# Altium project ttc2_project.prjpcb (part 2 of 2)

## Sheet 4_mcu_radio_1.schdoc: MCU Radio 1
size A3; DrawnBy: Sara Vega Martinez; Revision: v0.1; SheetNumber: 4; SheetTotal: 6; DesignedBy: André M. P. Mattos; ProjectRevision: v0.1
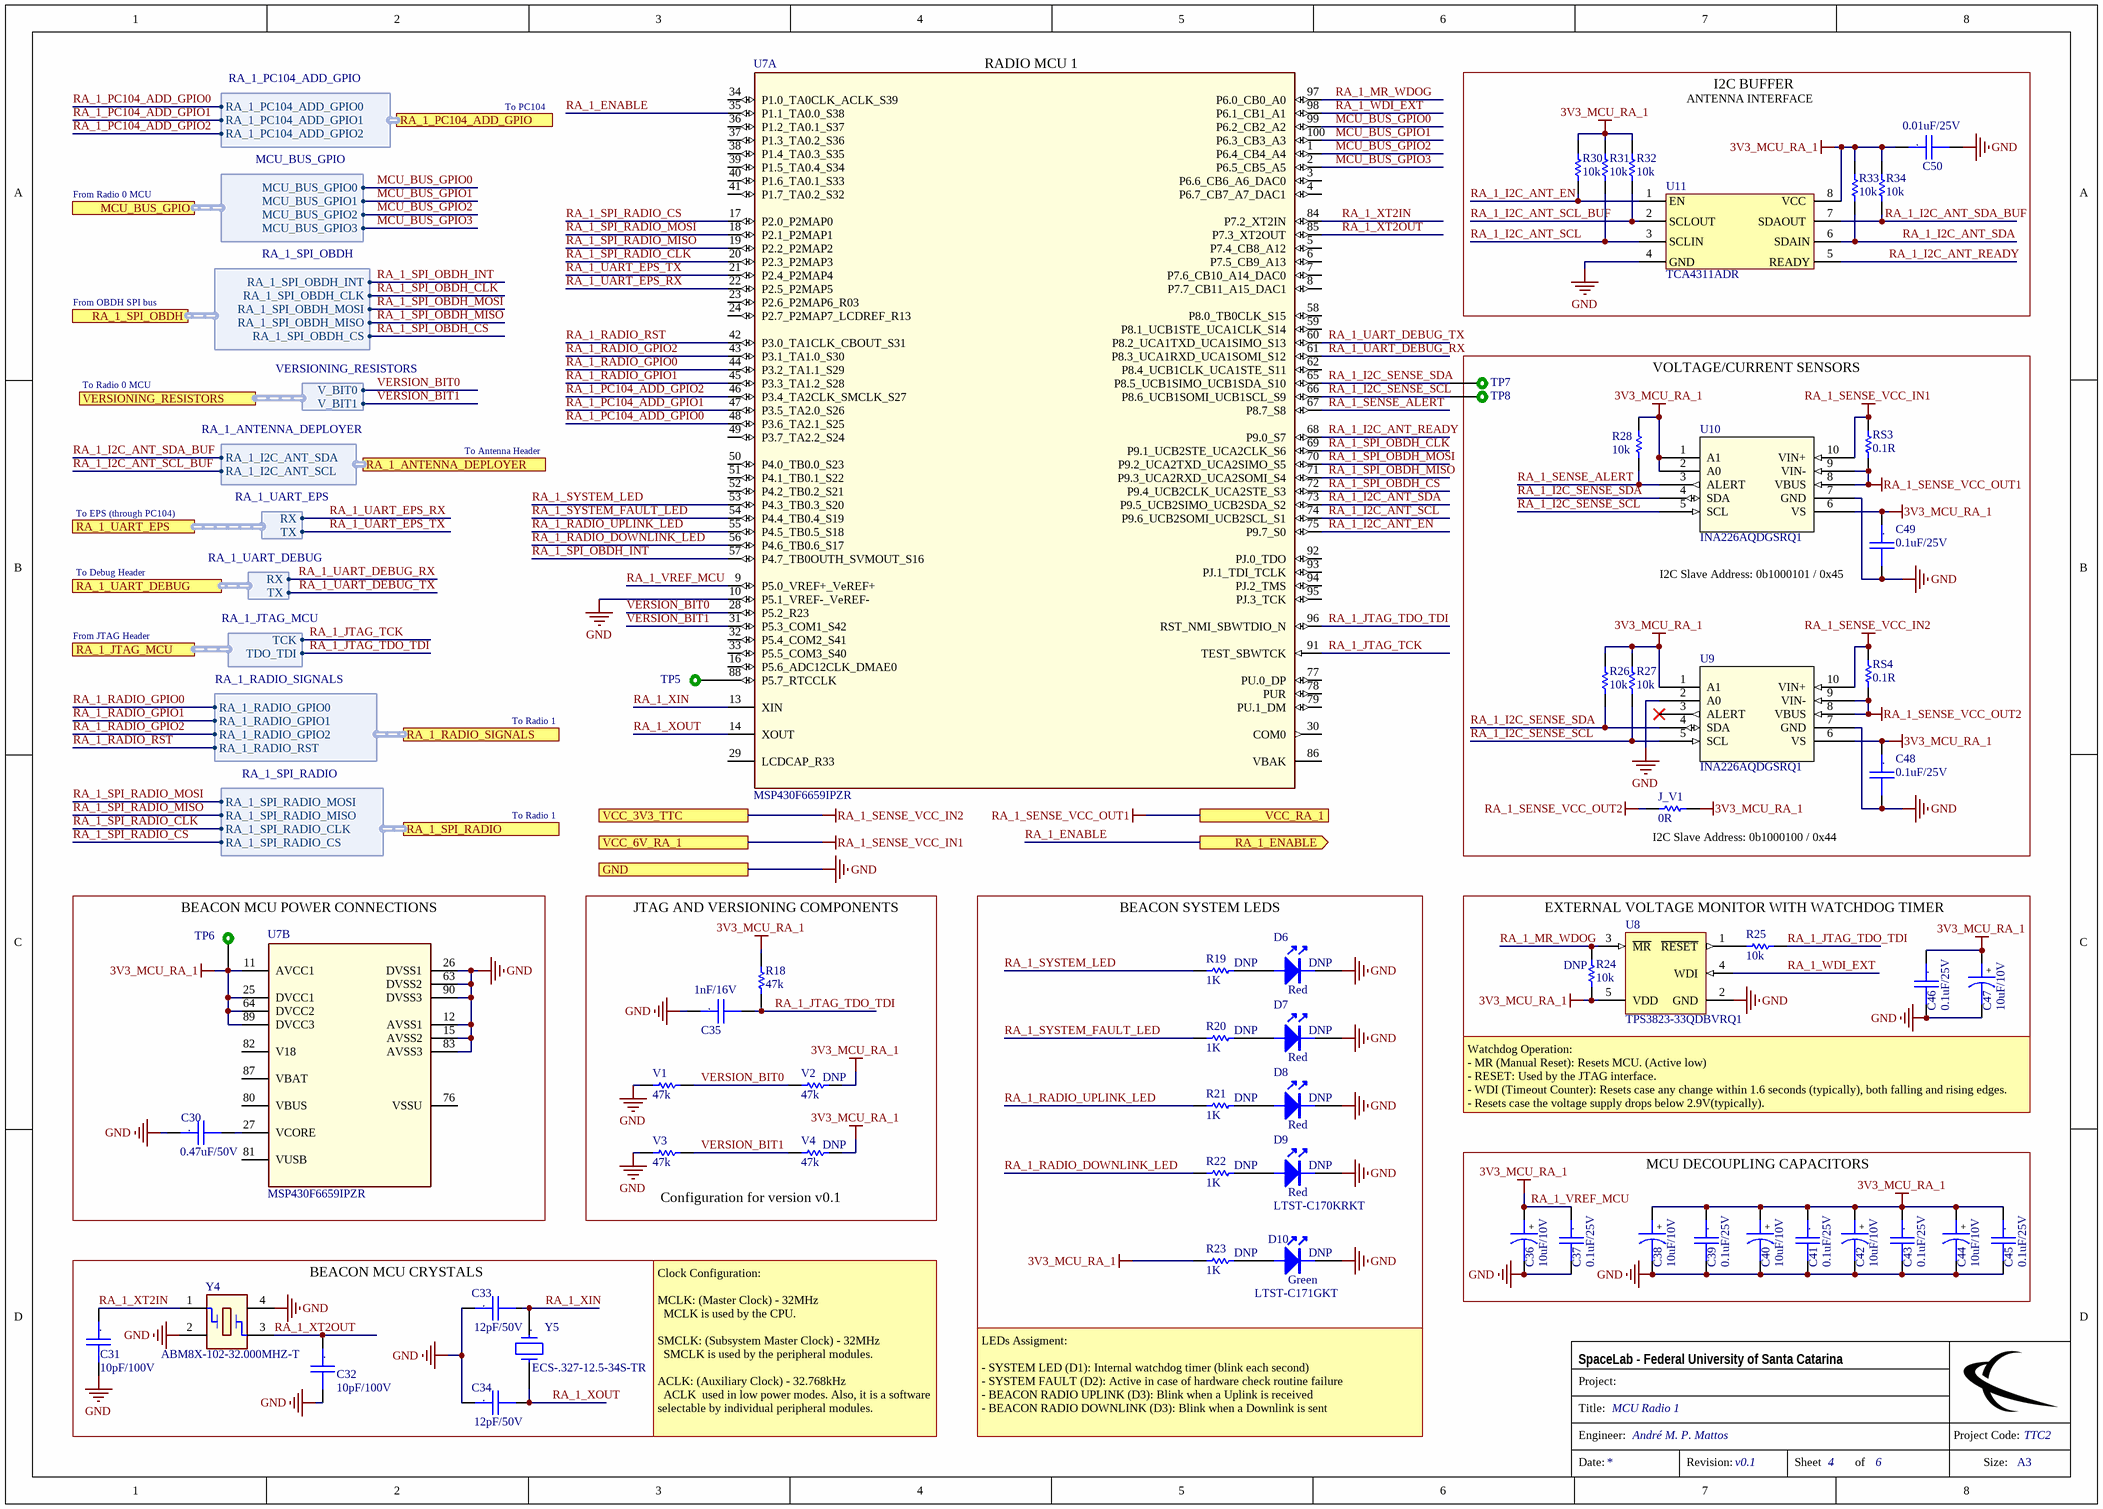
[diagram p5: 4_mcu_radio_1.schdoc]

### Parts
C30  0.47uF/50V  [CC0805]
C31  10pF/100V  [CC0805]
C32  10pF/100V  [CC0805]
C33  12pF/50V  [CC0805]
C34  12pF/50V  [CC0805]
C35  1nF/16V  [CC0603]
C36  10uF/10V  [CC0805_Tantalum]
C37  0.1uF/25V  [CC0805]
C38  10uF/10V  [CC0805_Tantalum]
C39  0.1uF/25V  [CC0805]
C40  10uF/10V  [CC0805_Tantalum]
C41  0.1uF/25V  [CC0805]
C42  10uF/10V  [CC0805_Tantalum]
C43  0.1uF/25V  [CC0805]
C44  10uF/10V  [CC0805_Tantalum]
C45  0.1uF/25V  [CC0805]
C46  0.1uF/25V  [CC0805]
C47  10uF/10V  [CC0805_Tantalum]
C48  0.1uF/25V  [CC0805]
C49  0.1uF/25V  [CC0805]
C50  0.01uF/25V  [CC0805]
D6  LTST-C170KRKT  [0805-RED-LED]  (value not drawn)
D7  LTST-C170KRKT  [0805-RED-LED]  (value not drawn)
D8  LTST-C170KRKT  [0805-RED-LED]  (value not drawn)
D9  LTST-C170KRKT  [0805-RED-LED]
D10  LTST-C171GKT  [0805-GREEN-LED]
J_V1  0R  [0805]
R18  47k  [0805]
R19  1K  [0805]
R20  1K  [0805]
R21  1K  [0805]
R22  1K  [0805]
R23  1K  [0805]
R24  10k  [0805]
R25  10k  [0805]
R26  10k  [0805]
R27  10k  [0805]
R28  10k  [0805]
R30  10k  [0805]
R31  10k  [0805]
R32  10k  [0805]
R33  10k  [0805]
R34  10k  [0805]
RS3  0.1R  [0805]
RS4  0.1R  [0805]
TP5  TEST_POINT  [TEST_POINT]  (value not drawn)  (no BOM)
TP6  TEST_POINT  [TEST_POINT]  (value not drawn)  (no BOM)
TP7  TEST_POINT  [TEST_POINT]  (value not drawn)  (no BOM)
TP8  TEST_POINT  [TEST_POINT]  (value not drawn)  (no BOM)
U7  MSP430F6659IPZR  [LQFP-100]  (parts A,B of 2)
U8  TPS3823-33QDBVRQ1  [DBV0005A_N]
U9  INA226AQDGSRQ1  [DGS10]
U10  INA226AQDGSRQ1  [DGS10]
U11  TCA4311ADR  [SOIC8]
V1  47k  [0805]
V2  47k  [0805]
V3  47k  [0805]
V4  47k  [0805]
Y4  ABM8X-102-32.000MHZ-T  [XTAL_ABM8X]
Y5  ECS-.327-12.5-34S-TR  [ABS06 0805]

### Blocks framed on the sheet
I2C BUFFER: C50 R30-R34 U11
VOLTAGE/CURRENT SENSORS: C48 C49 J_V1 R26-R28 RS3 RS4 TP7 TP8 U9 U10
BEACON MCU POWER CONNECTIONS: C30 TP6 U7
BEACON SYSTEM LEDS: D6-D10 R19-R23
EXTERNAL VOLTAGE MONITOR WITH WATCHDOG TIMER: C46 C47 R24 R25 U8
MCU DECOUPLING CAPACITORS: C36-C45
BEACON MCU CRYSTALS: C31-C34 Y4 Y5

### Ports
GND, MCU_BUS_GPIO (harness MCU_BUS_GPIO), RA_1_ANTENNA_DEPLOYER (harness RA_1_ANTENNA_DEPLOYER), RA_1_ENABLE (out), RA_1_JTAG_MCU (harness RA_1_JTAG_MCU), RA_1_PC104_ADD_GPIO (harness RA_1_PC104_ADD_GPIO), RA_1_RADIO_SIGNALS (harness RA_1_RADIO_SIGNALS), RA_1_SPI_OBDH (harness RA_1_SPI_OBDH), RA_1_SPI_RADIO (harness RA_1_SPI_RADIO), RA_1_UART_DEBUG (harness RA_1_UART_DEBUG), RA_1_UART_EPS (harness RA_1_UART_EPS), VCC_3V3_TTC, VCC_6V_RA_1, VCC_RA_1, VERSIONING_RESISTORS (harness VERSIONING_RESISTORS)

### Harnesses
RA_1_UART_EPS: RX, TX
RA_1_PC104_ADD_GPIO: RA_1_PC104_ADD_GPIO2, RA_1_PC104_ADD_GPIO1, RA_1_PC104_ADD_GPIO0
RA_1_RADIO_SIGNALS: RA_1_RADIO_GPIO2, RA_1_RADIO_RST, RA_1_RADIO_GPIO0, RA_1_RADIO_GPIO1
RA_1_SPI_RADIO: RA_1_SPI_RADIO_CLK, RA_1_SPI_RADIO_MISO, RA_1_SPI_RADIO_MOSI, RA_1_SPI_RADIO_CS
RA_1_JTAG_MCU: TDO_TDI, TCK
RA_1_UART_DEBUG: RX, TX
RA_1_ANTENNA_DEPLOYER: RA_1_I2C_ANT_SCL, RA_1_I2C_ANT_SDA
RA_1_SPI_OBDH: RA_1_SPI_OBDH_CLK, RA_1_SPI_OBDH_MOSI, RA_1_SPI_OBDH_MISO, RA_1_SPI_OBDH_CS, RA_1_SPI_OBDH_INT
MCU_BUS_GPIO: MCU_BUS_GPIO0, MCU_BUS_GPIO1, MCU_BUS_GPIO2, MCU_BUS_GPIO3
VERSIONING_RESISTORS: V_BIT0, V_BIT1

### Nets
GND: C30.1 C31.2 C32.2 C33.1 C34.1 C35.1 C36.2 C37.2 C38.2 C39.2 C40.2 C41.2 C42.2 C43.2 C44.2 C45.2 C46.2 C47.2 C48.2 C49.2 C50.2 D6.2(K) D7.2(K) D8.2(K) D9.2(K) D10.2(K) U7.10(P5.1_VREF-_VeREF-) U7.12(AVSS1) U7.15(AVSS2) U7.26(DVSS1) U7.63(DVSS2) U7.83(AVSS3) U7.90(DVSS3) U8.2(GND) U9.2(A0) U9.7(GND) U10.7(GND) U11.4(GND) V1.2 V3.2 Y4.2 Y4.4 ; port GND
RA_1_SENSE_VCC_IN1: RS3.2 U10.10(VIN+) ; port VCC_6V_RA_1  [project net VCC_6V_RA_1]
RA_1_SENSE_VCC_IN2: RS4.2 U9.10(VIN+) ; port VCC_3V3_TTC  [project net VCC_3V3_TTC]
RA_1_SENSE_VCC_OUT1: RS3.1 U10.8(VBUS) U10.9(VIN-) ; port VCC_RA_1
RA_1_SENSE_VCC_OUT2: J_V1.2 RS4.1 U9.8(VBUS) U9.9(VIN-)
RA_1_VREF_MCU: C36.1 C37.1 C38.1 C39.1 C40.1 C41.1 C42.1 C43.1 C44.1 C45.1 C46.1 C47.1 C48.1 C49.1 C50.1 J_V1.1 R18.2 R23.2 R24.1 R26.2 R27.2 R28.2 R30.2 R31.2 R32.2 R33.2 R34.2 TP6.1 U7.9(P5.0_VREF+_VeREF+) U7.11(AVCC1) U7.25(DVCC1) U7.64(DVCC2) U7.89(DVCC3) U8.5(VDD) U9.1(A1) U9.6(VS) U10.1(A1) U10.2(A0) U10.6(VS) U11.8(VCC) V2.1 V4.1  [also labelled 3V3_MCU_RA_1]
MCU_BUS_GPIO0: U7.99(P6.2_CB2_A2) ; port MCU_BUS_GPIO.MCU_BUS_GPIO0
MCU_BUS_GPIO1: U7.100(P6.3_CB3_A3) ; port MCU_BUS_GPIO.MCU_BUS_GPIO1
MCU_BUS_GPIO2: U7.1(P6.4_CB4_A4) ; port MCU_BUS_GPIO.MCU_BUS_GPIO2
MCU_BUS_GPIO3: U7.2(P6.5_CB5_A5) ; port MCU_BUS_GPIO.MCU_BUS_GPIO3
RA_1_ENABLE: U7.35(P1.1_TA0.0_S38) ; port RA_1_ENABLE
RA_1_I2C_ANT_EN: R30.1 U7.75(P9.7_S0) U11.1(EN)
RA_1_I2C_ANT_READY: U7.68(P9.0_S7) U11.5(READY)
RA_1_I2C_ANT_SCL: R31.1 U7.74(P9.6_UCB2SOMI_UCB2SCL_S1) U11.3(SCLIN)
RA_1_I2C_ANT_SCL_BUF: R32.1 U11.2(SCLOUT) ; port RA_1_ANTENNA_DEPLOYER.RA_1_I2C_ANT_SCL
RA_1_I2C_ANT_SDA: R33.1 U7.73(P9.5_UCB2SIMO_UCB2SDA_S2) U11.6(SDAIN)
RA_1_I2C_ANT_SDA_BUF: R34.1 U11.7(SDAOUT) ; port RA_1_ANTENNA_DEPLOYER.RA_1_I2C_ANT_SDA
RA_1_I2C_SENSE_SCL: R27.1 TP8.1 U7.66(P8.6_UCB1SOMI_UCB1SCL_S9) U9.5(SCL) U10.5(SCL)
RA_1_I2C_SENSE_SDA: R26.1 TP7.1 U7.65(P8.5_UCB1SIMO_UCB1SDA_S10) U9.4(SDA) U10.4(SDA)
RA_1_JTAG_TCK: U7.91(TEST_SBWTCK) ; port RA_1_JTAG_MCU.TCK
RA_1_JTAG_TDO_TDI: C35.2 R18.1 R25.1 U7.96(RST_NMI_SBWTDIO_N) ; port RA_1_JTAG_MCU.TDO_TDI
RA_1_MR_WDOG: R24.2 U7.97(P6.0_CB0_A0) U8.3(~{MR})
RA_1_PC104_ADD_GPIO0: U7.48(P3.6_TA2.1_S25) ; port RA_1_PC104_ADD_GPIO.RA_1_PC104_ADD_GPIO0
RA_1_PC104_ADD_GPIO1: U7.47(P3.5_TA2.0_S26) ; port RA_1_PC104_ADD_GPIO.RA_1_PC104_ADD_GPIO1
RA_1_PC104_ADD_GPIO2: U7.46(P3.4_TA2CLK_SMCLK_S27) ; port RA_1_PC104_ADD_GPIO.RA_1_PC104_ADD_GPIO2
RA_1_RADIO_DOWNLINK_LED: R22.2 U7.56(P4.6_TB0.6_S17)
RA_1_RADIO_GPIO0: U7.44(P3.2_TA1.1_S29) ; port RA_1_RADIO_SIGNALS.RA_1_RADIO_GPIO0
RA_1_RADIO_GPIO1: U7.45(P3.3_TA1.2_S28) ; port RA_1_RADIO_SIGNALS.RA_1_RADIO_GPIO1
RA_1_RADIO_GPIO2: U7.43(P3.1_TA1.0_S30) ; port RA_1_RADIO_SIGNALS.RA_1_RADIO_GPIO2
RA_1_RADIO_RST: U7.42(P3.0_TA1CLK_CBOUT_S31) ; port RA_1_RADIO_SIGNALS.RA_1_RADIO_RST
RA_1_RADIO_UPLINK_LED: R21.2 U7.55(P4.5_TB0.5_S18)
RA_1_SENSE_ALERT: R28.1 U7.67(P8.7_S8) U10.3(ALERT)
RA_1_SPI_OBDH_CLK: U7.69(P9.1_UCB2STE_UCA2CLK_S6) ; port RA_1_SPI_OBDH.RA_1_SPI_OBDH_CLK
RA_1_SPI_OBDH_CS: U7.72(P9.4_UCB2CLK_UCA2STE_S3) ; port RA_1_SPI_OBDH.RA_1_SPI_OBDH_CS
RA_1_SPI_OBDH_INT: U7.57(P4.7_TB0OUTH_SVMOUT_S16) ; port RA_1_SPI_OBDH.RA_1_SPI_OBDH_INT
RA_1_SPI_OBDH_MISO: U7.71(P9.3_UCA2RXD_UCA2SOMI_S4) ; port RA_1_SPI_OBDH.RA_1_SPI_OBDH_MISO
RA_1_SPI_OBDH_MOSI: U7.70(P9.2_UCA2TXD_UCA2SIMO_S5) ; port RA_1_SPI_OBDH.RA_1_SPI_OBDH_MOSI
RA_1_SPI_RADIO_CLK: U7.20(P2.3_P2MAP3) ; port RA_1_SPI_RADIO.RA_1_SPI_RADIO_CLK
RA_1_SPI_RADIO_CS: U7.17(P2.0_P2MAP0) ; port RA_1_SPI_RADIO.RA_1_SPI_RADIO_CS
RA_1_SPI_RADIO_MISO: U7.19(P2.2_P2MAP2) ; port RA_1_SPI_RADIO.RA_1_SPI_RADIO_MISO
RA_1_SPI_RADIO_MOSI: U7.18(P2.1_P2MAP1) ; port RA_1_SPI_RADIO.RA_1_SPI_RADIO_MOSI
RA_1_SYSTEM_FAULT_LED: R20.2 U7.54(P4.4_TB0.4_S19)
RA_1_SYSTEM_LED: R19.2 U7.53(P4.3_TB0.3_S20)
RA_1_UART_DEBUG_RX: U7.61(P8.3_UCA1RXD_UCA1SOMI_S12) ; port RA_1_UART_DEBUG.RX
RA_1_UART_DEBUG_TX: U7.60(P8.2_UCA1TXD_UCA1SIMO_S13) ; port RA_1_UART_DEBUG.TX
RA_1_UART_EPS_RX: U7.22(P2.5_P2MAP5) ; port RA_1_UART_EPS.RX
RA_1_UART_EPS_TX: U7.21(P2.4_P2MAP4) ; port RA_1_UART_EPS.TX
RA_1_WDI_EXT: U7.98(P6.1_CB1_A1) U8.4(WDI)
RA_1_XIN: C33.2 U7.13(XIN) Y5.1
RA_1_XOUT: C34.2 U7.14(XOUT) Y5.2
RA_1_XT2IN: C31.1 U7.84(P7.2_XT2IN) Y4.1
RA_1_XT2OUT: C32.1 U7.85(P7.3_XT2OUT) Y4.3
VERSION_BIT0: U7.28(P5.2_R23) V1.1 V2.2 ; port VERSIONING_RESISTORS.V_BIT0
VERSION_BIT1: U7.31(P5.3_COM1_S42) V3.1 V4.2 ; port VERSIONING_RESISTORS.V_BIT1
NetC30_2: C30.2 U7.27(VCORE)
NetD6_1: D6.1(A) R19.1
NetD7_1: D7.1(A) R20.1
NetD8_1: D8.1(A) R21.1
NetD9_1: D9.1(A) R22.1
NetD10_1: D10.1(A) R23.1
NetR25_2: R25.2 U8.1(~{RESET})
NetTP5_1: TP5.1 U7.88(P5.7_RTCCLK)

Not connected (* = marked no-connect by the designer): U7 3(P6.6_CB6_A6_DAC0) 4(P6.7_CB7_A7_DAC1) 5(P7.4_CB8_A12) 6(P7.5_CB9_A13) 7(P7.6_CB10_A14_DAC0) 8(P7.7_CB11_A15_DAC1) 16(P5.6_ADC12CLK_DMAE0) 23(P2.6_P2MAP6_R03) 24(P2.7_P2MAP7_LCDREF_R13) 29(LCDCAP_R33) 30(COM0) 32(P5.4_COM2_S41) 33(P5.5_COM3_S40) 34(P1.0_TA0CLK_ACLK_S39) 36(P1.2_TA0.1_S37) 37(P1.3_TA0.2_S36) 38(P1.4_TA0.3_S35) 39(P1.5_TA0.4_S34) 40(P1.6_TA0.1_S33) 41(P1.7_TA0.2_S32) 49(P3.7_TA2.2_S24) 50(P4.0_TB0.0_S23) 51(P4.1_TB0.1_S22) 52(P4.2_TB0.2_S21) 58(P8.0_TB0CLK_S15) 59(P8.1_UCB1STE_UCA1CLK_S14) 62(P8.4_UCB1CLK_UCA1STE_S11) 76(VSSU) 77(PU.0_DP) 78(PUR) 79(PU.1_DM) 80(VBUS) 81(VUSB) 82(V18) 86(VBAK) 87(VBAT) 92(PJ.0_TDO) 93(PJ.1_TDI_TCLK) 94(PJ.2_TMS) 95(PJ.3_TCK); U9 3(ALERT)*

### Notes on the sheet
- To PC104
- (near U7) RADIO MCU 1
- ANTENNA INTERFACE
- From Radio 0 MCU
- From OBDH SPI bus
- To Radio 0 MCU
- To Antenna Header
- To EPS (through PC104)
- To Debug Header
- I2C Slave Address: 0b1000101 / 0x45
- From JTAG Header
- To Radio 1
- (near J_V1) I2C Slave Address: 0b1000100 / 0x44
- (near R18) JTAG AND VERSIONING COMPONENTS
- (near R19) DNP
- (near D6) DNP
- (near R24) DNP
- (near R20) DNP
- (near D7) DNP
- (near V2) DNP
- (near R21) DNP
- (near D8) DNP
- Watchdog Operation:
  - MR (Manual Reset): Resets MCU. (Active low)
  - RESET: Used by the JTAG interface.
  - WDI (Timeout Counter): Resets case any change within 1.6 seconds (typically), both falling and rising edges.
  - Resets case the voltage supply drops below 2.9V(typically).
- (near V4) DNP
- (near R22) DNP
- (near D9) DNP
- Configuration for version v0.1
- (near R23) DNP
- (near D10) DNP
- Clock Configuration:
  MCLK: (Master Clock) - 32MHz
  MCLK is used by the CPU.
  SMCLK: (Subsystem Master Clock) - 32MHz
  SMCLK is used by the peripheral modules.
  ACLK: (Auxiliary Clock) - 32.768kHz
  ACLK  used in low power modes. Also, it is a software selectable by individual peripheral modules.
- LEDs Assigment:
  - SYSTEM LED (D1): Internal watchdog timer (blink each second)
  - SYSTEM FAULT (D2): Active in case of hardware check routine failure
  - BEACON RADIO UPLINK (D3): Blink when a Uplink is received
  - BEACON RADIO DOWNLINK (D3): Blink when a Downlink is sent
- Project:
- SpaceLab - Federal University of Santa Catarina
- Title:
- Engineer:
- Project Code:
- Date:
- Revision:
- Sheet
- of
- Size:
- A3
- (in symbol Cap_Cer_X7R_0.1uF_25V_0805) .
- (in symbol Cap_Cer_X7R_0.01uF_25V_0805) .
- (in symbol Cap_Cer_X7R_0.47uF_50V_0805) .
- (in symbol Cap_Cer_X7R_1nF_16V_0603) .
- (in symbol Cap_Cer_X7R_10pF_100V_0805) .
- (in symbol Cap_Cer_X7R_12pF_50V_0805) .
- (in symbol Cap_Tant_SMD_10uF_10V_0805) +
- (in symbol LED/G_0805) Green
- (in symbol LED/R_0805) Red
- (in symbol Xtal_32.768kHz_12pF_2_SMD) .

### Library data of the parts
C30 = Cap_Cer_X7R_0.47uF_50V_0805: CAP CER 0.47UF 50V 10% X7R 0805; Partnumber: C0805C474K5RACTU; NCM: 8532.24.10
C31 C32 = Cap_Cer_X7R_10pF_100V_0805: CAP CER 10pF 100V 0805; Partnumber: 08051A100FAT2A; NCM: 8532.24.10
C33 C34 = Cap_Cer_X7R_12pF_50V_0805: CAP CER 12pF 50V 0805; Partnumber: CL21C120FBANNNC; NCM: 8532.24.10
C35 = Cap_Cer_X7R_1nF_16V_0603: CAP CER 1nF 16V 0603 5%; Partnumber: C0603X102J4RECAUTO; NCM: 8532.24.10
C36 C38 C40 C42 C44 C47 = Cap_Tant_SMD_10uF_10V_0805: CAP Tantalum 10uF 10V 20% 0805; Partnumber: TPSP106M010R2000; NCM: 8532.21.11
C37 C39 C41 C43 C45 C46 C48 C49 = Cap_Cer_X7R_0.1uF_25V_0805: CAP CER 0.1UF 25V 10% X7R 0805; Partnumber: CC0805KRX7R8BB104; NCM: 8532.24.10
C50 = Cap_Cer_X7R_0.01uF_25V_0805: CAP CER 0.01uF 25V 10% X7R 0805; Partnumber: CL21B103KAANNNC; NCM: 8532.24.10
D6-D9 = LED/R_0805: LED Red SMD - Red 631nm LED Indication, Discrete 2V 0805 (2012 Metric); NCM: 8541.40.21; Partnumber: LTST-C170KRKT
D10 = LED/G_0805: LED Green SMD - Green 569nm LED Indication - Discrete 2.1V 0805 (2012 Metric); NCM: 8541.40.21; Partnumber: LTST-C171GKT
J_V1 = R0R_JUMPER_1/8W_0805: RES 0R OHM 1/8W JUMPER 0805; Partnumber: CRCW08050000Z0EA; NCM: 8533.21.20
R18 V1-V4 = R47k_1%_1/8W_0805: RES 47k OHM 1/8W 1% 0805; Partnumber: RC0805FR-0747KL; NCM: 8533.21.20
R19-R23 = R1.0k_1%_1/8W_0805: RES 1.0K OHM 1/8W 1% 0805; Partnumber: RC0805FR-071KL; NCM: 8533.21.20
R24-R28 R30-R34 = R10k_1%_1/8W_0805: RES 10K OHM 1/8W 1%  0805; Partnumber: CRCW080510K0FKEA; NCM: 8533.21.20
RS3 RS4 = R0.1R_1%_1/3W_0805: RES 0.1R OHM 1/3W 1% 0805; Partnumber: SR732ATTER100F; NCM: 8533.21.20
TP5-TP8 = TEST_POINT: Test point
U7 = MSP430F6659IPZR: CPUXV2 series Microcontroller IC 16-Bit 20MHz 512KB (512K x 8) FLASH 100-LQFP (14x14); Manufacturer: Texas Instruments; PIN_COUNT: 100; Application_BuildNumber: *; PartNumber: MSP430F6659IPZR; Alternate PartNumber: MSP430F6659IPZ; PackageReference: PZ0100A; MountType: SMT; CompType: IC; RoHS: Y; RefDes: RefDes; Type: DEV; Value: Value
U8 = CMP-0338-00011-2: Processor Supervisory Circuit, 1 Supply Monitored, -40 to 85 degC, 5-Pin SOT-23 (DBV), Green (RoHS & no Sb/Br); Manufacturer: Texas Instruments; Iq: 15 uA Typ.; Threshold Voltage: 2.93 V Typ.; Watchdog Timer WDI: 0.2 s; VCC: 1.1 V Min.; Reset Threshold Accuracy: 2.4%; Rating: Catalog; Time Delay: 25 ms; # of Supplies Monitored: 1; Output Driver Type / Reset Output: Active-low, Push-pull; Packing: Tape and Reel; ComponentLink1Description: Manufacturer URL; RoHS: TRUE; PackageDescription: 5-Pin Plastic Small Outline, Body 1.6 x 2.9 mm, Pitch 0.95 mm; Mounting Technology: Surface Mount; ComponentLink1URL: www.ti.com; PackageReference: DBV0005A; ComponentLink3URL: http://www.ti.com/lit/ml/mpds018j/mpds018j.pdf; ComponentLink3Description: Package Specification; PartNumber: TPS3823-33QDBVRQ1; DatasheetVersion: SLVS165J; ComponentLink2Description: Datasheet; PackageVersion: 4073253-4/L; ComponentLink2URL: http://www.ti.com/lit/ds/symlink/tps3820-33.pdf; Operating Temperature Range: -40 to 85 degC
U9 U10 = INA226AQDGSRQ1: High-Side Measurement, Bi-Directional Current/Power Monitor w/I2C Interface; Manufacturer: Texas Instruments; GENERIC_PART_NUMBER: INA226; INDUSTRY_STD_PKG_TYPE: MSOP; FAMILY_NAME: CURRENT SHUNT MONITOR; PIN_COUNT: 10; PACKAGE_DESIGNATOR: DGS; Datasheet_URL: http://www.ti.com/lit/gpn/INA226; Vendor: Texas Instruments; Manufacturer_Part_Number: INA226AQDGSRQ1; Copyright: Copyright (C) 2018 Accelerated Designs. All rights reserved; RefDes: RefDes; Type: DEV; Partnumber: INA226AQDGSRQ1
U11 = TCA4311ADR: IC SIGNAL BUFFER I2C 8SOIC HOTSWAP; Partnumber: TCA4311ADR
Y4 = XTAL_32MHz_SMD_4-SMD: 32MHz ±10ppm Crystal 10pF 60 Ohm -40°C ~ 125°C; Partnumber: ABM8X-102-32.000MHZ-T; NCM: 8541.60.10
Y5 = Xtal_32.768kHz_12pF_2_SMD: 32.768kHz ±20ppm Crystal 12.5pF 70 kOhm -40°C ~ 125°C; Partnumber: ECS-.327-12.5-34S-TR; NCM: 8541.60.10

## Sheet 6_radio_1.schdoc: Radio 1
size A4; DrawnBy: Sara Vega Martinez; Revision: v0.1; SheetNumber: 6; SheetTotal: 6; ProjectCode: TTC2; DesignedBy: André M. P. Mattos
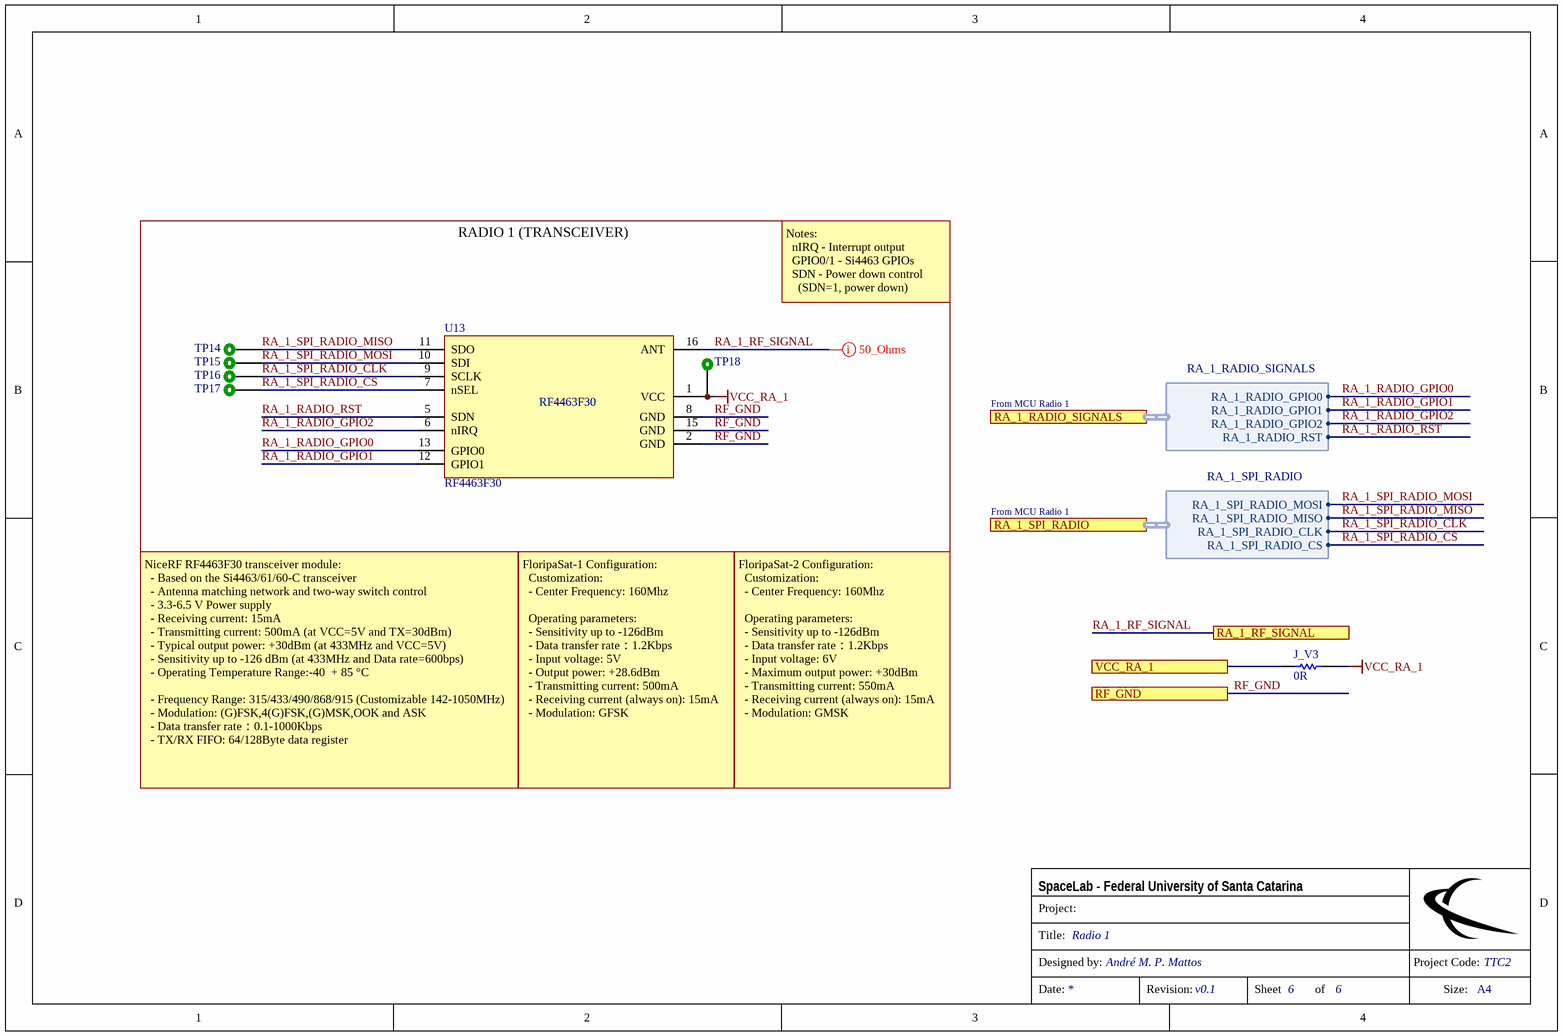
[diagram p6: 6_radio_1.schdoc]

### Parts
J_V3  0R  [0805]
TP14  TEST_POINT  [TEST_POINT]  (value not drawn)  (no BOM)
TP15  TEST_POINT  [TEST_POINT]  (value not drawn)  (no BOM)
TP16  TEST_POINT  [TEST_POINT]  (value not drawn)  (no BOM)
TP17  TEST_POINT  [TEST_POINT]  (value not drawn)  (no BOM)
TP18  TEST_POINT  [TEST_POINT]  (value not drawn)  (no BOM)
U13  RF4463F30  [RF4463F30]

### Blocks framed on the sheet
RADIO 1 (TRANSCEIVER): TP14-TP18 U13

### Ports
RA_1_RADIO_SIGNALS (harness RA_1_RADIO_SIGNALS), RA_1_RF_SIGNAL, RA_1_SPI_RADIO (harness RA_1_SPI_RADIO), RF_GND, VCC_RA_1

### Harnesses
RA_1_RADIO_SIGNALS: RA_1_RADIO_GPIO2, RA_1_RADIO_RST, RA_1_RADIO_GPIO0, RA_1_RADIO_GPIO1
RA_1_SPI_RADIO: RA_1_SPI_RADIO_CLK, RA_1_SPI_RADIO_MISO, RA_1_SPI_RADIO_MOSI, RA_1_SPI_RADIO_CS

### Nets
RA_1_SENSE_VCC_OUT1: J_V3.2 ; port VCC_RA_1
VCC_RA_1: J_V3.1 TP18.1 U13.1(VCC)
RA_1_RADIO_GPIO0: U13.13(GPIO0) ; port RA_1_RADIO_SIGNALS.RA_1_RADIO_GPIO0
RA_1_RADIO_GPIO1: U13.12(GPIO1) ; port RA_1_RADIO_SIGNALS.RA_1_RADIO_GPIO1
RA_1_RADIO_GPIO2: U13.6(nIRQ) ; port RA_1_RADIO_SIGNALS.RA_1_RADIO_GPIO2
RA_1_RADIO_RST: U13.5(SDN) ; port RA_1_RADIO_SIGNALS.RA_1_RADIO_RST
RA_1_RF_SIGNAL: U13.16(ANT) ; port RA_1_RF_SIGNAL
RA_1_SPI_RADIO_CLK: TP16.1 U13.9(SCLK) ; port RA_1_SPI_RADIO.RA_1_SPI_RADIO_CLK
RA_1_SPI_RADIO_CS: TP17.1 U13.7(nSEL) ; port RA_1_SPI_RADIO.RA_1_SPI_RADIO_CS
RA_1_SPI_RADIO_MISO: TP14.1 U13.11(SDO) ; port RA_1_SPI_RADIO.RA_1_SPI_RADIO_MISO
RA_1_SPI_RADIO_MOSI: TP15.1 U13.10(SDI) ; port RA_1_SPI_RADIO.RA_1_SPI_RADIO_MOSI
RF_GND: U13.2(GND) U13.8(GND) U13.15(GND) ; port RF_GND

### Layout directives
net class 50Ohm_Net: RA_1_RF_SIGNAL

### Notes on the sheet
- Notes:
  nIRQ - Interrupt output
  GPIO0/1 - Si4463 GPIOs
  SDN - Power down control
  (SDN=1, power down)
- From MCU Radio 1
- NiceRF RF4463F30 transceiver module:
  - Based on the Si4463/61/60-C transceiver
  - Antenna matching network and two-way switch control
  - 3.3-6.5 V Power supply
  - Receiving current: 15mA
  - Transmitting current: 500mA (at VCC=5V and TX=30dBm)
  - Typical output power: +30dBm (at 433MHz and VCC=5V)
  - Sensitivity up to -126 dBm (at 433MHz and Data rate=600bps)
  - Operating Temperature Range:-40  + 85 °C
  - Frequency Range: 315/433/490/868/915 (Customizable 142-1050MHz)
  - Modulation: (G)FSK,4(G)FSK,(G)MSK,OOK and ASK
  - Data transfer rate：0.1-1000Kbps
  - TX/RX FIFO: 64/128Byte data register
- FloripaSat-1 Configuration:
  Customization:
  - Center Frequency: 160Mhz
  Operating parameters:
  - Sensitivity up to -126dBm
  - Data transfer rate：1.2Kbps
  - Input voltage: 5V
  - Output power: +28.6dBm
  - Transmitting current: 500mA
  - Receiving current (always on): 15mA
  - Modulation: GFSK
- FloripaSat-2 Configuration:
  Customization:
  - Center Frequency: 160Mhz
  Operating parameters:
  - Sensitivity up to -126dBm
  - Data transfer rate：1.2Kbps
  - Input voltage: 6V
  - Maximum output power: +30dBm
  - Transmitting current: 550mA
  - Receiving current (always on): 15mA
  - Modulation: GMSK
- Project:
- SpaceLab - Federal University of Santa Catarina
- Title:
- Designed by:
- Project Code:
- Date:
- Revision:
- Sheet
- of
- Size:
- A4

### Library data of the parts
J_V3 = R0R_JUMPER_1/8W_0805: as J_V1 on sheet 4_mcu_radio_1; NCM: 8533.21.20
TP14-TP18 = TEST_POINT: Test point
U13 = RF4463F30: RF4463F30 High Power Wireless Transceiver Module; Partnumber: RF4463F30

## Nets that join several sheets
GND: 1_interface (20 pins), 3_mcu_radio_0 (40 pins), 4_mcu_radio_1 (42 pins)
RA_0_SENSE_VCC_OUT1: 3_mcu_radio_0 (RS1.1 U5.8 U5.9), 5_radio_0 (J_V2.2)
RA_1_SENSE_VCC_OUT1: 4_mcu_radio_1 (RS3.1 U10.8 U10.9), 6_radio_1 (J_V3.2)
VCC_3V3_TTC: 1_interface (CN9.1 PC104.H2-27 PC104.H2-28), 3_mcu_radio_0 (RS2.2 U4.10), 4_mcu_radio_1 (RS4.2 U9.10)
VCC_5V_RA_0: 1_interface (PC104.H1-49 PC104.H1-50), 3_mcu_radio_0 (RS1.2 U5.10)
VCC_6V_RA_1: 1_interface (PC104.H1-51 PC104.H1-52), 4_mcu_radio_1 (RS3.2 U10.10)
ESD: 0_architecture (MEC4.0), 1_interface (ESD.2)
MCU_BUS_GPIO0: 3_mcu_radio_0 (U2.52), 4_mcu_radio_1 (U7.99)
MCU_BUS_GPIO1: 3_mcu_radio_0 (U2.51), 4_mcu_radio_1 (U7.100)
MCU_BUS_GPIO2: 3_mcu_radio_0 (U2.50), 4_mcu_radio_1 (U7.1)
MCU_BUS_GPIO3: 3_mcu_radio_0 (U2.49), 4_mcu_radio_1 (U7.2)
RA_0_ENABLE: 1_interface (J_P8.1), 3_mcu_radio_0 (U2.35)
RA_0_I2C_ANT_SCL_BUF: 1_interface (CN1.4), 3_mcu_radio_0 (R15.1 U6.2)
RA_0_I2C_ANT_SDA_BUF: 1_interface (CN1.3), 3_mcu_radio_0 (R17.1 U6.7)
RA_0_JTAG_TCK: 1_interface (CN3.7 CN5.3), 3_mcu_radio_0 (U2.91)
RA_0_JTAG_TDO_TDI: 1_interface (CN3.1 CN5.2), 3_mcu_radio_0 (C6.2 R1.1 R8.1 U2.96)
RA_0_PC104_ADD_GPIO3: 1_interface (J_P14.1), 3_mcu_radio_0 (U2.46)
RA_0_PC104_ADD_GPIO4: 1_interface (J_P9.1), 3_mcu_radio_0 (U2.47)
RA_0_PC104_ADD_GPIO5: 1_interface (J_P10.1), 3_mcu_radio_0 (U2.48)
RA_0_RADIO_GPIO0: 3_mcu_radio_0 (U2.44), 5_radio_0 (TP50.1 U12.13)
RA_0_RADIO_GPIO1: 3_mcu_radio_0 (U2.45), 5_radio_0 (TP51.1 U12.12)
RA_0_RADIO_GPIO2: 3_mcu_radio_0 (U2.43), 5_radio_0 (TP49.1 U12.6)
RA_0_RADIO_GPIO3: 3_mcu_radio_0 (U2.42), 5_radio_0 (TP48.1 U12.5)
RA_0_RF_SIGNAL: 1_interface (Y0.1), 5_radio_0 (U12.16)
RA_0_SPI_OBDH_CLK: 1_interface (PC104.H1-35), 3_mcu_radio_0 (U2.69)
RA_0_SPI_OBDH_CS: 1_interface (PC104.H1-40), 3_mcu_radio_0 (U2.72)
RA_0_SPI_OBDH_INT: 1_interface (PC104.H1-9), 3_mcu_radio_0 (U2.57)
RA_0_SPI_OBDH_MISO: 1_interface (PC104.H1-37), 3_mcu_radio_0 (U2.71)
RA_0_SPI_OBDH_MOSI: 1_interface (PC104.H1-39), 3_mcu_radio_0 (U2.70)
RA_0_SPI_RADIO_CLK: 3_mcu_radio_0 (U2.20), 5_radio_0 (TP46.1 U12.9)
RA_0_SPI_RADIO_CS: 3_mcu_radio_0 (U2.17), 5_radio_0 (TP47.1 U12.7)
RA_0_SPI_RADIO_MISO: 3_mcu_radio_0 (U2.19), 5_radio_0 (TP44.1 U12.11)
RA_0_SPI_RADIO_MOSI: 3_mcu_radio_0 (U2.18), 5_radio_0 (TP45.1 U12.10)
RA_0_UART_ADD_RX: 1_interface (J_P4.2), 3_mcu_radio_0 (U2.22)
RA_0_UART_ADD_TX: 1_interface (J_P5.2), 3_mcu_radio_0 (U2.21)
RA_0_UART_DEBUG_RX: 1_interface (CN3.14 CN5.5 CN8.2), 3_mcu_radio_0 (U2.61)
RA_0_UART_DEBUG_TX: 1_interface (CN3.12 CN5.4 CN8.1), 3_mcu_radio_0 (U2.60)
RA_1_ENABLE: 1_interface (J_P7.1), 4_mcu_radio_1 (U7.35)
RA_1_I2C_ANT_SCL_BUF: 1_interface (CN2.4), 4_mcu_radio_1 (R32.1 U11.2)
RA_1_I2C_ANT_SDA_BUF: 1_interface (CN2.3), 4_mcu_radio_1 (R34.1 U11.7)
RA_1_JTAG_TCK: 1_interface (CN4.7 CN6.3), 4_mcu_radio_1 (U7.91)
RA_1_JTAG_TDO_TDI: 1_interface (CN4.1 CN6.2), 4_mcu_radio_1 (C35.2 R18.1 R25.1 U7.96)
RA_1_PC104_ADD_GPIO0: 1_interface (J_P11.1), 4_mcu_radio_1 (U7.48)
RA_1_PC104_ADD_GPIO1: 1_interface (J_P12.1), 4_mcu_radio_1 (U7.47)
RA_1_PC104_ADD_GPIO2: 1_interface (J_P13.1), 4_mcu_radio_1 (U7.46)
RA_1_RADIO_GPIO0: 4_mcu_radio_1 (U7.44), 6_radio_1 (U13.13)
RA_1_RADIO_GPIO1: 4_mcu_radio_1 (U7.45), 6_radio_1 (U13.12)
RA_1_RADIO_GPIO2: 4_mcu_radio_1 (U7.43), 6_radio_1 (U13.6)
RA_1_RADIO_RST: 4_mcu_radio_1 (U7.42), 6_radio_1 (U13.5)
RA_1_RF_SIGNAL: 1_interface (Y1.1), 6_radio_1 (U13.16)
RA_1_SPI_OBDH_CLK: 1_interface (PC104.H2-12), 4_mcu_radio_1 (U7.69)
RA_1_SPI_OBDH_CS: 1_interface (PC104.H2-13), 4_mcu_radio_1 (U7.72)
RA_1_SPI_OBDH_INT: 1_interface (PC104.H1-7), 4_mcu_radio_1 (U7.57)
RA_1_SPI_OBDH_MISO: 1_interface (PC104.H2-14), 4_mcu_radio_1 (U7.71)
RA_1_SPI_OBDH_MOSI: 1_interface (PC104.H2-11), 4_mcu_radio_1 (U7.70)
RA_1_SPI_RADIO_CLK: 4_mcu_radio_1 (U7.20), 6_radio_1 (TP16.1 U13.9)
RA_1_SPI_RADIO_CS: 4_mcu_radio_1 (U7.17), 6_radio_1 (TP17.1 U13.7)
RA_1_SPI_RADIO_MISO: 4_mcu_radio_1 (U7.19), 6_radio_1 (TP14.1 U13.11)
RA_1_SPI_RADIO_MOSI: 4_mcu_radio_1 (U7.18), 6_radio_1 (TP15.1 U13.10)
RA_1_UART_DEBUG_RX: 1_interface (CN4.14 CN6.5 CN7.2), 4_mcu_radio_1 (U7.61)
RA_1_UART_DEBUG_TX: 1_interface (CN4.12 CN6.4 CN7.1), 4_mcu_radio_1 (U7.60)
RA_1_UART_EPS_RX: 1_interface (PC104.H2-5), 4_mcu_radio_1 (U7.22)
RA_1_UART_EPS_TX: 1_interface (PC104.H2-7), 4_mcu_radio_1 (U7.21)
RF_GND: 1_interface (FB1.2 Y0.2 Y1.2), 5_radio_0 (U12.2 U12.8 U12.15), 6_radio_1 (U13.2 U13.8 U13.15)
VERSION_BIT0: 3_mcu_radio_0 (U2.28), 4_mcu_radio_1 (U7.28 V1.1 V2.2)
VERSION_BIT1: 3_mcu_radio_0 (U2.31), 4_mcu_radio_1 (U7.31 V3.1 V4.2)